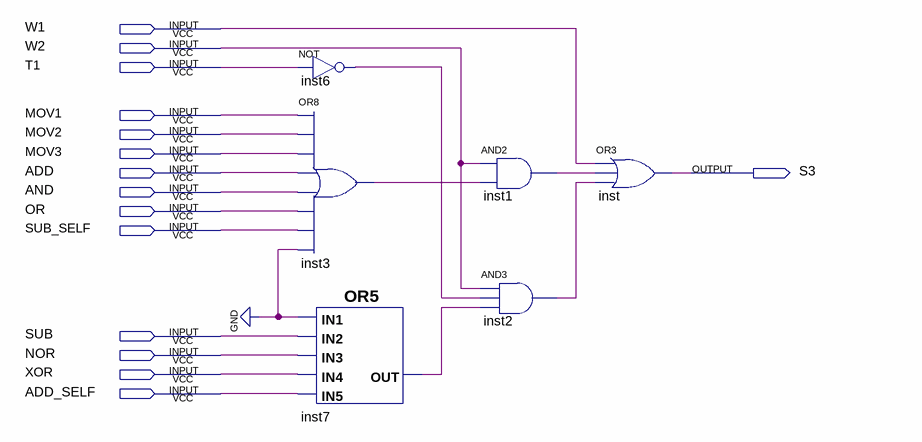
[diagram p0: schematic sheet]
// Quartus schematic S3.bdf as structural Verilog: 6 symbols, 15 pins
module S3 (
  input  W1,
  input  W2,
  input  T1,
  input  MOV1,
  input  MOV2,
  input  MOV3,
  input  ADD,
  input  AND,
  input  OR,
  input  SUB_SELF,
  input  SUB,
  input  NOR,
  input  XOR,
  input  ADD_SELF,
  output S3
);

  wire inst1_out, inst2_out, inst3_out, inst6_out, inst7_out;

  not inst6 (inst6_out, T1);
  or inst3 (inst3_out, MOV1, MOV2, MOV3, ADD, AND, OR, SUB_SELF, 1'b0);
  or inst7 (inst7_out, 1'b0, SUB, NOR, XOR, ADD_SELF);
  and inst1 (inst1_out, W2, inst3_out);
  and inst2 (inst2_out, W2, inst6_out, inst7_out);
  or inst (S3, W1, inst1_out, inst2_out);
endmodule
